# EAGLE design bldcshield (EAGLE 8.5.0)
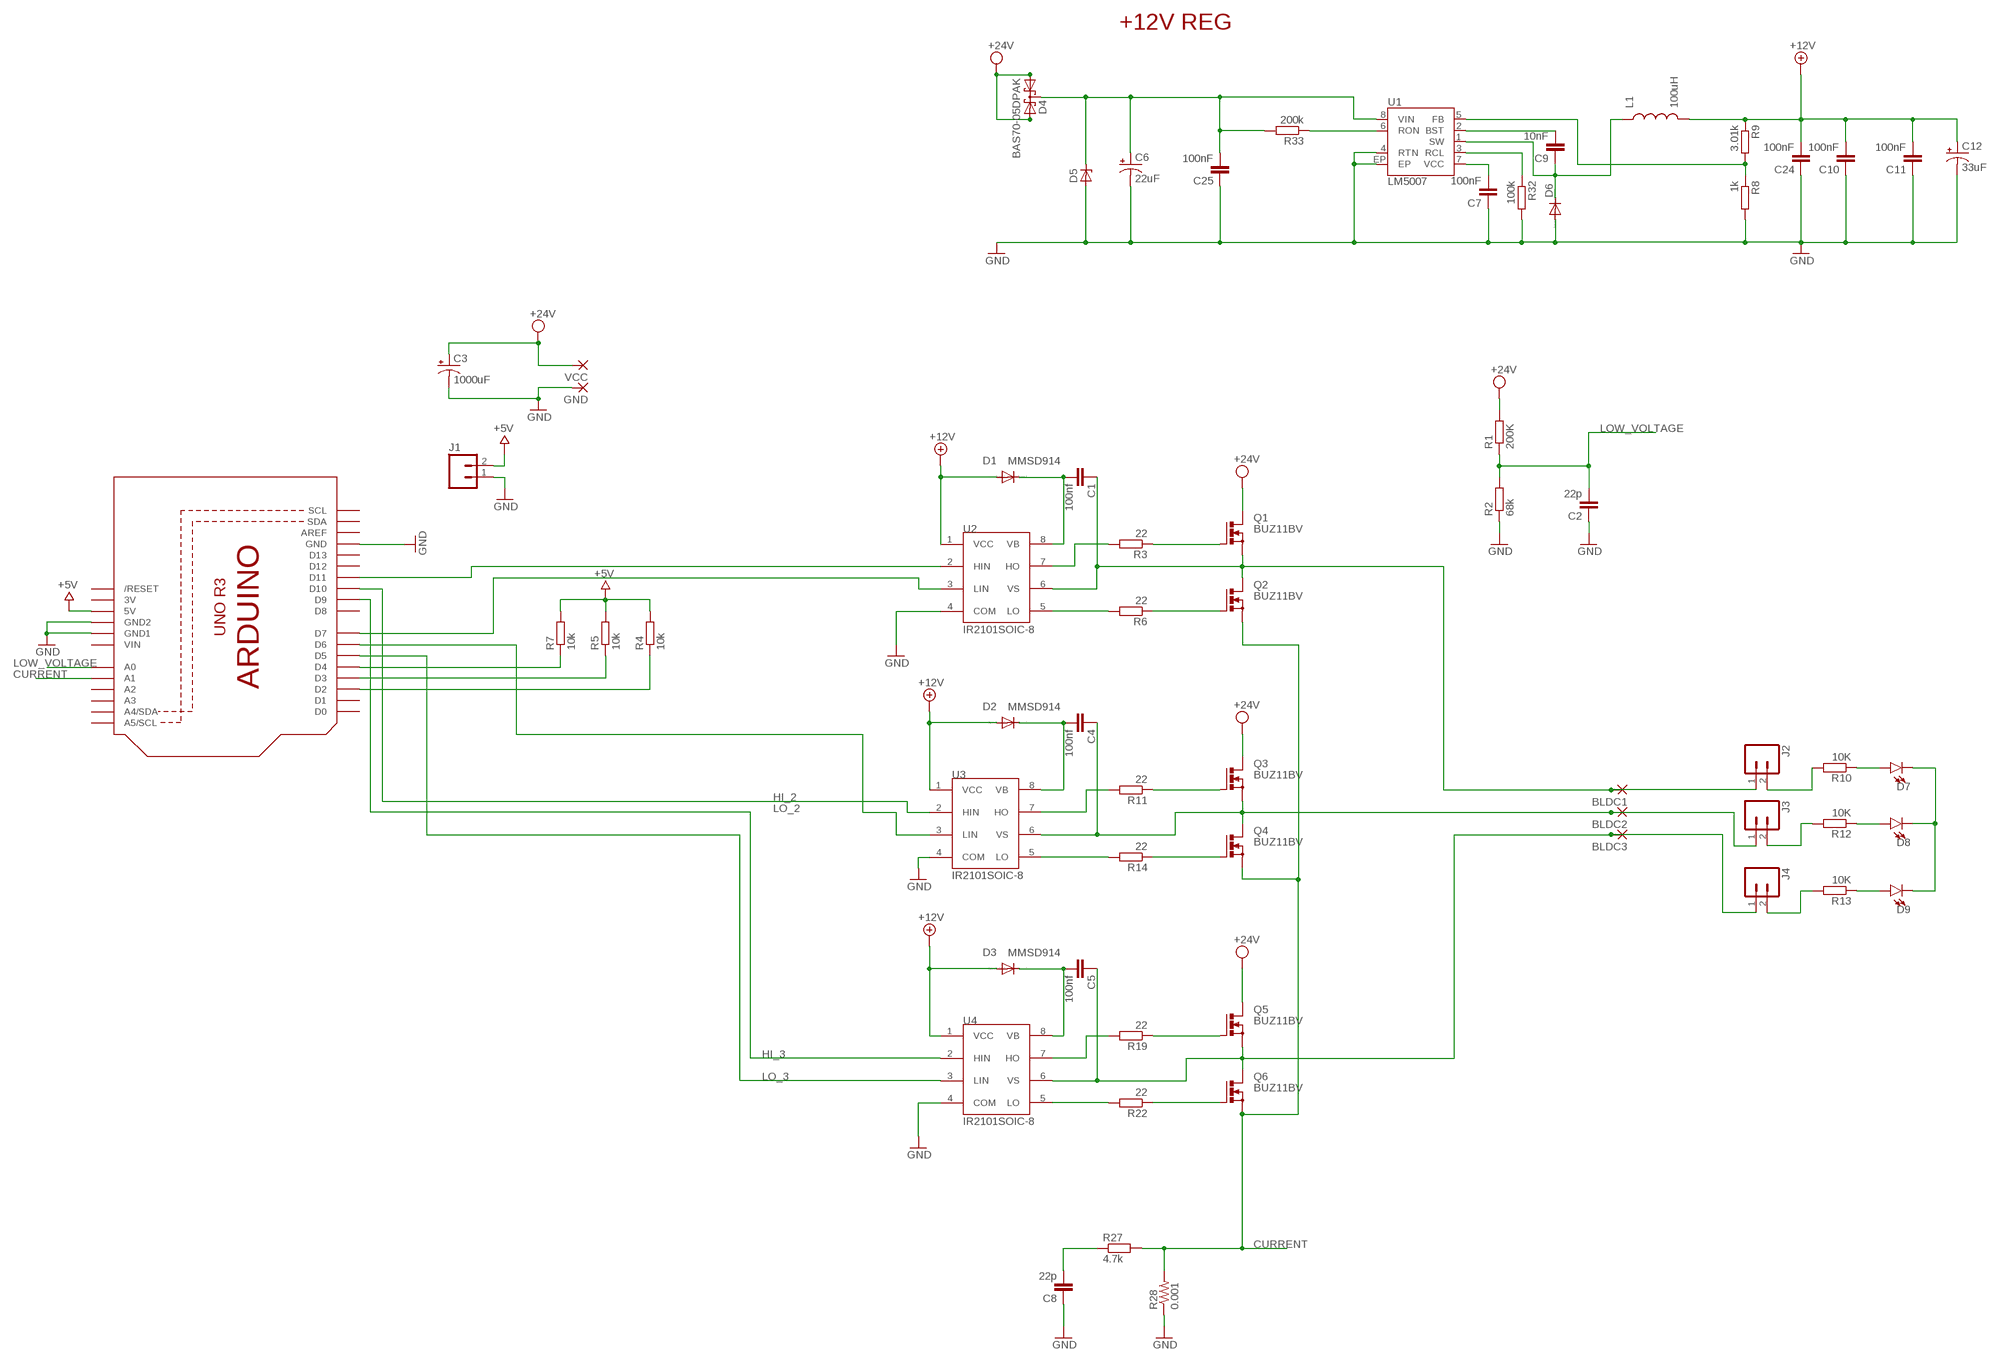
[diagram p0: schematic, sheet 1]

## Parts
BLDC1  WIREPAD4,16O1,6  [4,16O1,6]
BLDC2  WIREPAD4,16O1,6  [4,16O1,6]
BLDC3  WIREPAD4,16O1,6  [4,16O1,6]
C1  100nf  C-EUC1206  [C1206]
C2  22p  C-EUC1206  [C1206]
C3  1000uF  CAP_POLPTH3  [CPOL-RADIAL-1000UF-63V]
C4  100nf  C-EUC1206  [C1206]
C5  100nf  C-EUC1206  [C1206]
C6  22uF  22UF-POLAR-PANASONIC_C-35V-20%  [PANASONIC_C]
C7  100nF  C-EUC1206  [C1206]
C8  22p  C-EUC1206  [C1206]
C9  10nF  C-EUC1206  [C1206]
C10  100nF  C-EUC1206  [C1206]
C11  100nF  C-EUC1206  [C1206]
C12  33uF  22UF-POLAR-PANASONIC_C-35V-20%  [PANASONIC_C]
C24  100nF  C-EUC1206  [C1206]
C25  100nF  C-EUC1206  [C1206]
D1  MMSD914  DIODE-SOD123  [SOD123]
D2  MMSD914  DIODE-SOD123  [SOD123]
D3  MMSD914  DIODE-SOD123  [SOD123]
D4  BAS70-05DPAK  [DPAK229P990X238-3N]
D5  SMF43A  [SOD123F]
D6  MBR0520LT  [SOD123]
D7  LED5MM  [LED_5MM]
D8  LED5MM  [LED_5MM]
D9  LED5MM  [LED_5MM]
GND  WIREPAD4,16O1,6  [4,16O1,6]
J1  M02PTH  [1X02]
J2  M02PTH  [1X02]
J3  M02PTH  [1X02]
J4  M02PTH  [1X02]
L1  100uH  INDUCTOR  [INDUCTOR-SRP4020]
Q1  BUZ11BV  [TO220BV]
Q2  BUZ11BV  [TO220BV]
Q3  BUZ11BV  [TO220BV]
Q4  BUZ11BV  [TO220BV]
Q5  BUZ11BV  [TO220BV]
Q6  BUZ11BV  [TO220BV]
Q8  Shield  ARDUINOR3-NOIOREF-NOTEXT  [ARDUINOR3-NOTEXT-NOIOREF]
R1  200K  R-EU_R1206  [R1206]
R2  68k  R-EU_R1206  [R1206]
R3  22  R-EU_R1206  [R1206]
R4  10k  R-EU_R1206  [R1206]
R5  10k  R-EU_R1206  [R1206]
R6  22  R-EU_R1206  [R1206]
R7  10k  R-EU_R1206  [R1206]
R8  1k  R-EU_R1206  [R1206]
R9  3.01k  R-EU_R1206  [R1206]
R10  10K  R-EU_R1206  [R1206]
R11  22  R-EU_R1206  [R1206]
R12  10K  R-EU_R1206  [R1206]
R13  10K  R-EU_R1206  [R1206]
R14  22  R-EU_R1206  [R1206]
R19  22  R-EU_R1206  [R1206]
R22  22  R-EU_R1206  [R1206]
R27  4.7k  R-EU_R1206  [R1206]
R28  0.001  R-US_R2512  [R2512]
R32  100k  R-EU_R1206  [R1206]
R33  200k  R-EU_R1206  [R1206]
U1  LM5007  [MSOP-8-EP]
U2  IR2101SOIC-8  [SOIC127P490X600X175-8N]
U3  IR2101SOIC-8  [SOIC127P490X600X175-8N]
U4  IR2101SOIC-8  [SOIC127P490X600X175-8N]
VCC  WIREPAD4,16O1,6  [4,16O1,6]

## Nets
+5V [usbvcc]: J1.2 Q8.5V R4.2 R5.2 R7.2
+12V: C10.2 C11.2 C12.+ C24.2 D1.A D2.A D3.A L1.P$2 R9.1 U2.1(VCC) U3.1(VCC) U4.1(VCC)
BLDC1: BLDC1.1(P) C1.1 J2.1 Q1.S Q2.D U2.6(VS)
BLDC2: BLDC2.1(P) C4.1 J3.1 Q3.S Q4.D U3.6(VS)
BLDC3: BLDC3.1(P) C5.1 J4.1 Q5.S Q6.D U4.6(VS)
CURRENT: Q2.S Q4.S Q6.S Q8.A1 R27.2 R28.2
GND [gnd]: C2.1 C3.2(-) C6.- C7.1 C8.1 C10.1 C11.1 C12.- C24.1 C25.1 D5.A D6.A GND.1(P) J1.1 Q8.GND Q8.GND1 Q8.GND2 R2.1 R8.2 R28.1 R32.2 U1.4(RTN) U1.EP U2.4(COM) U3.4(COM) U4.4(COM)
HI_2: Q8.D10 U3.2(HIN)
HI_3: Q8.D9 U4.2(HIN)
LO_2: Q8.D6 U3.3(LIN)
LO_3: Q8.D5 U4.3(LIN)
LOW_VOLTAGE: C2.2 Q8.A0 R1.1 R2.2
N$1: Q3.G R11.1
N$2: C6.+ C25.2 D4.4(K1K2) D5.C R33.2 U1.8(VIN)
N$4: Q8.D11 U2.2(HIN)
N$5: Q8.D4 R7.1
N$6: Q8.D3 R5.1
N$7: Q8.D2 R4.1
N$8: Q8.D7 U2.3(LIN)
N$9: C8.2 R27.1
N$10: R6.2 U2.5(LO)
N$11: R3.2 U2.7(HO)
N$12: R33.1 U1.6(RON)
N$13: R19.2 U4.7(HO)
N$14: Q5.G R19.1
N$15: Q6.G R22.1
N$16: R22.2 U4.5(LO)
N$17: C9.2 U1.2(BST)
N$18: C7.2 U1.7(VCC)
N$19: C9.1 D6.C L1.P$1 U1.1(SW)
N$20: R32.1 U1.3(RCL)
N$21: R11.2 U3.7(HO)
N$23: Q4.G R14.1
N$24: R14.2 U3.5(LO)
N$25: J2.2 R10.2
N$26: R8.1 R9.2 U1.5(FB)
N$27: J3.2 R12.2
N$28: J4.2 R13.2
N$29: D7.A R10.1
N$30: Q1.G R3.1
N$31: Q2.G R6.1
N$32: D8.A R12.1
N$33: D9.A R13.1
N$34: D7.K(C) D8.K(C) D9.K(C)
VB1 [usbvcc]: C1.2 D1.C U2.8(VB)
VB2 [usbvcc]: C4.2 D2.C U3.8(VB)
VB3 [usbvcc]: C5.2 D3.C U4.8(VB)
VCC: C3.1(+) D4.1(A1) D4.3(A2) Q1.D Q3.D Q5.D R1.2 VCC.1(P) ; supply symbol labelled +24V
Unconnected: Q8.A2 Q8.A3 Q8.A4(A4/SDA) Q8.A5(A5/SCL) Q8.AREF Q8.D0 Q8.D1 Q8.D8 Q8.D12 Q8.D13 Q8.RESET(/RESET) Q8.SCL Q8.SDA

## Notes on the sheet
- +12V REG

## Power pins joined to a net without a drawn wire
3V: Q8.3V
VIN: Q8.VIN

## Library data of the parts
BLDC1-BLDC3 GND VCC = wirepad:WIREPAD: Wire PAD connect wire on PCB
C1 C2 C4 C5 C7-C11 C24 C25 = SmartPrj:C-EU: CAPACITOR, European symbol
C3 = SparkFun-Passives:CAP_POL: Capacitor Polarized These are standard SMD and PTH capacitors. Normally 10uF, 47uF, and 100uF in electrolytic and tantalum varieties. Always verify the external diameter of the through hole cap, it varies with capacity, voltage, and manufacturer. The EIA devices should be standard.
C6 = SparkFun-Capacitors:22UF-POLAR: 22µF polarized capacitors A capacitor is a passive two-terminal electrical component used to store electrical energy temporarily in an electric field.; PROD_ID: CAP-08618
C12 = SparkFun-Capacitors:22UF-POLAR: 22µF polarized capacitors A capacitor is a passive two-terminal electrical component used to store electrical energy temporarily in an electric field.; PROD_ID: CAP-08618; VALUE: 22uF
D1-D3 = diode:DIODE-: DIODE
D4 = SCHOTTKY:BAS70-05: General-purpose Schottky diodes General-purpose Schottky diodes in small Surface-Mounted Device (SMD) plastic packages AAL Eindhoven MK
D5 = smf_11:SMF*A: SMF Series TVS Diodes Source: http://www.littelfuse.com/~/media/electronics/datasheets/tvs_diodes/littelfuse_tvs_diode_smf_datasheet.pdf.pdf; MF: Littelfuse; MPN: SMF43A; OC_FARNELL: unknown; OC_NEWARK: unknown
D6 = diode:MBR0520LT: SCHOTTKY BARRIER RECTIFIER Source: http://onsemi.com .. MBR0520LT1-D.pdf
D7-D9 = SparkFun-LED:LED: LED (Generic) Standard schematic elements and footprints for 5mm, 3mm, 1206, and 0603 sized LEDs. Generic LEDs with no color specified.
J1-J4 = SparkFun-Connectors:M02: Standard 2-pin 0.1" header. Use with - straight break away headers ( PRT-00116) - right angle break away headers (PRT-00553) - swiss pins (PRT-00743) - machine pins (PRT-00117) - female headers (PRT-00115) Molex polarized connector foot print use with: PRT-08233 with associated crimp pins and housings. 2.54_SCREWTERM for use with PRT-10571. 3.5mm Screw Terminal footprints for PRT-08084 5mm Screw Terminal footprints for use with PRT-08432
L1 = SparkFun-Passives:INDUCTOR: Inductors Basic Inductor/Choke - 0603 and 1206. Footprints are not proven and vary greatly between part numbers. INDUCTOR POWER 3.3UH 4.0A SMD 0.197" L x 0.197" W x 0.177" H (5.00mm x 5.00mm x 4.50mm)
Q1-Q6 = transistor-power:BUZ11: N-CHANNEL MOS FET
Q8 = adafruit:ARDUINOR3-NOIOREF
R1-R14 R19 R22 R27 R32 R33 = SmartPrj:R-EU_: RESISTOR, European symbol
R28 = resistor:R-US_: RESISTOR, American symbol
U1 = SparkFun-PowerIC:LM5007: High Voltage (80V) Step-down switching regulator http://www.national.com/ds/LM/LM5007.pdf
U2-U4 = SnapEDA-Library:IR2101: High and low side driver

## Net classes
0 default: width 0.254 mm, drill 0.61 mm, clearance 0.203 mm
2 gnd: width 0.254 mm, drill 0.61 mm, clearance 0.254 mm
3 usbvcc: width 0.254 mm, drill 0.61 mm, clearance 0.254 mm

## Board
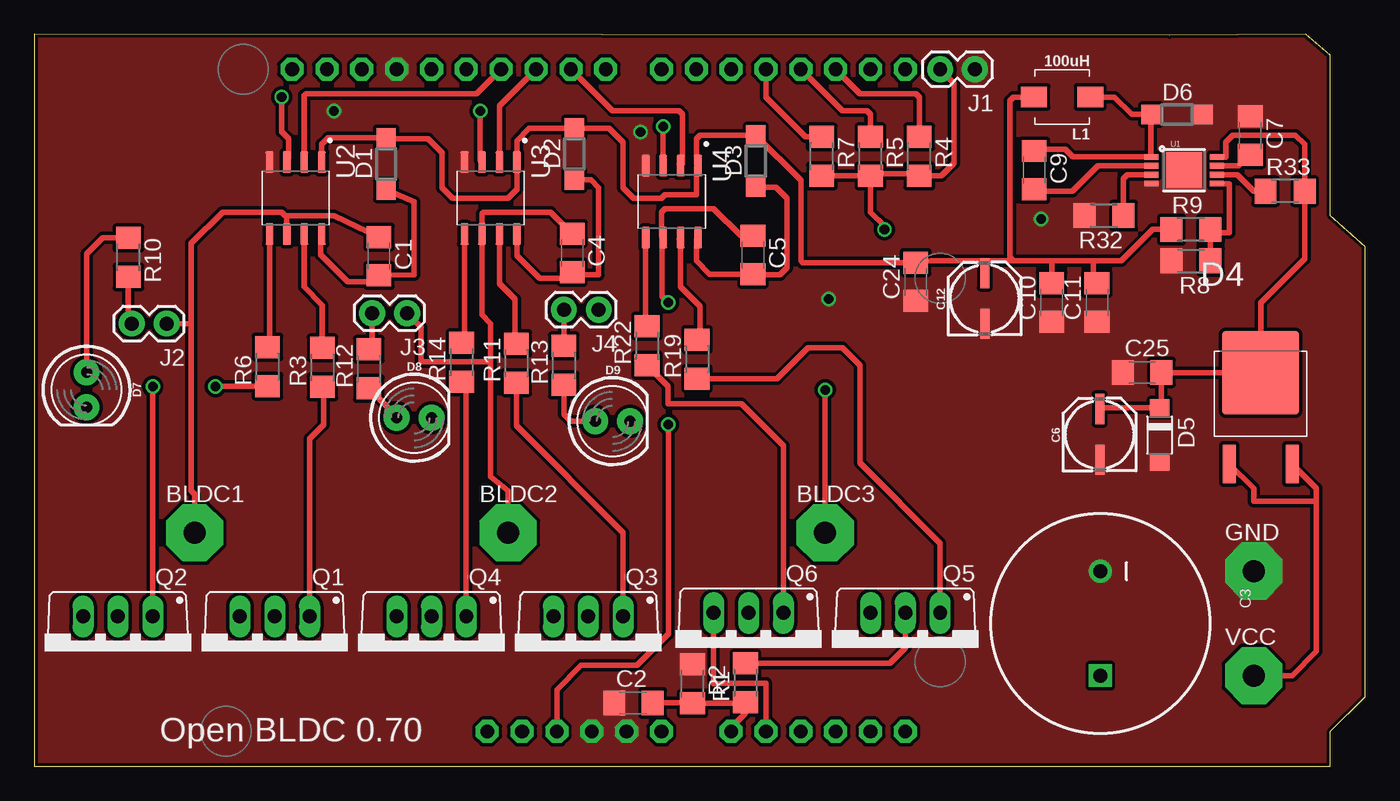
[diagram p1: board, top side]
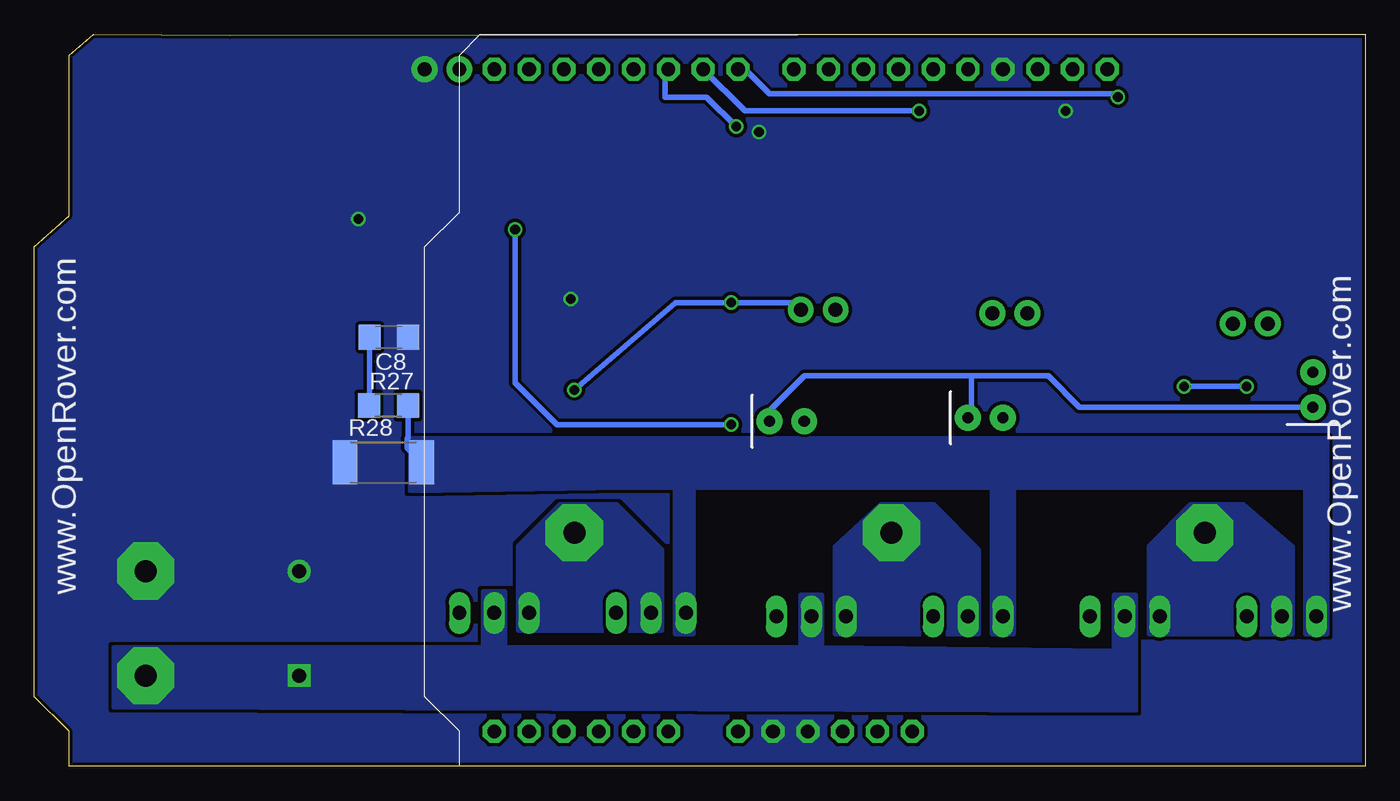
[diagram p2: board, bottom side, seen from below]

Size 97.03 x 53.34 mm. Coordinates in mm from the lower left corner, seen from the top.
Outline: 0,0 94.49,0 94.49,2.54 97.03,5.08 97.03,37.85 94.49,40.13 94.49,51.82 92.71,53.34 82.78,53.26 0,53.34 0,0
Copper layers (1*16): Top 0.035mm / dielectric 1.5mm / Bottom 0.035mm
Design rules "dirt_cheap_dirty_boards.v1": minimum track width 5mil, minimum drill 12mil, track to track 5mil, track to pad 5mil, pad to pad 5mil, via to via 5mil, smd to smd 0mil, copper to edge 10mil, drill to drill 10mil, minimum pad ring 10mil, minimum via ring 6mil, stop-mask expansion 2mil, vias tented up to drill 25mil, thermal gap 10mil

### Footprints (pad centres in the part's own frame; a part is rotated, then mirrored left to right if it is on the bottom)
4,16O1,6 = drill 1.6 pad 4.166 octagon: 1 0,0
C1206 = smd 1.6 x 1.8: 1 -1.4,0; 2 1.4,0
CPOL-RADIAL-1000UF-63V = drill 1.016 pad 1.651 square: 1 3.81,0 | drill 1.016 pad 1.676: 2 -3.81,0
PANASONIC_C = smd 2.2 x 0.65: + 1.9,-0.2; - -1.8,-0.2
SOD123 = smd 1.4 x 1.4: A 1.9,0; C -1.9,0
DPAK229P990X238-3N = smd 0.97 x 2.83: 1 -2.29,-4.14; 3 2.29,-4.14 | smd 5.63 x 6.09: 4 0,2.51
SOD123F = smd 1.2 x 1.4: A 2,0; C -2,0
LED_5MM = drill 0.813 pad 1.88: A -1.27,0; K 1.27,0
1X02 = drill 1.016 pad 1.88: 1 0,0; 2 2.54,0
INDUCTOR-SRP4020 = smd 1.9 x 1.5: P$1 -2.05,0; P$2 2.05,0
TO220BV = drill 1.016 long: D 0,-2.54; G -2.54,-2.54; S 2.54,-2.54
ARDUINOR3-NOTEXT-NOIOREF = drill 1 pad 1.676 octagon: 3V 35.56,2.54; 5V 38.1,2.54; A0 50.8,2.54; A1 53.34,2.54; A2 55.88,2.54; A3 58.42,2.54; A4 60.96,2.54; A5 63.5,2.54; AREF 23.876,50.8; D0 63.5,50.8; D1 60.96,50.8; D2 58.42,50.8; D3 55.88,50.8; D4 53.34,50.8; D5 50.8,50.8; D6 48.26,50.8; D7 45.72,50.8; D8 41.656,50.8; D9 39.116,50.8; D10 36.576,50.8; D11 34.036,50.8; D12 31.496,50.8; D13 28.956,50.8; GND 26.416,50.8; GND1 43.18,2.54; GND2 40.64,2.54; RESET 33.02,2.54; SCL 18.796,50.8; SDA 21.336,50.8; VIN 45.72,2.54
R1206 = smd 1.6 x 1.803: 1 -1.422,0; 2 1.422,0
R2512 = smd 1.8 x 3.2: 1 -2.8,0; 2 2.8,0
MSOP-8-EP = smd 0.41 x 1.02: 1 -0.975,-2.4; 2 -0.325,-2.4; 3 0.325,-2.4; 4 0.975,-2.4; 5 0.975,2.4; 6 0.325,2.4; 7 -0.325,2.4; 8 -0.975,2.4 | smd 2.6 x 2.6: EP 0,0
SOIC127P490X600X175-8N = smd 1.58 x 0.59: 1 -2.625,1.905; 2 -2.625,0.635; 3 -2.625,-0.635; 4 -2.625,-1.905; 5 2.625,-1.905; 6 2.625,-0.635; 7 2.625,0.635; 8 2.625,1.905

### Placement (x,y rotation side)
BLDC1  11.68,17.02 0 top
BLDC2  34.54,17.02 0 top
BLDC3  57.66,17.02 0 top
C1  25.13,37.17 270 top
C2  43.68,4.61 0 top
C3  77.72,10.41 270 top
C4  39.21,37.41 270 top
C5  52.39,37.27 270 top
C6  77.47,24.13 90 top
C7  88.65,45.97 270 top
C8  71.17,31.26 180 bottom
C9  72.9,43.43 270 top
C10  74.17,33.78 90 top
C11  77.47,33.78 90 top
C12  69.09,34.04 90 top
C24  64.26,35.31 90 top
C25  80.77,28.7 0 top
D1  25.65,43.89 90 top
D2  39.37,44.62 90 top
D3  52.59,44.1 90 top
D4  89.41,26.16 0 top
D5  82.04,24.13 270 top
D6  83.31,47.5 0 top
D7  3.81,27.43 270 top
D8  27.69,25.4 0 top
D9  42.16,25.15 0 top
GND  88.9,14.22 0 top
J1  68.58,50.8 180 top
J2  9.65,32.26 180 top
J3  27.18,33.02 180 top
J4  41.15,33.27 180 top
L1  74.93,48.77 180 top
Q1  17.53,8.38 180 top
Q2  6.1,8.38 180 top
Q3  40.39,8.38 180 top
Q4  28.96,8.38 180 top
Q5  63.5,8.64 180 top
Q6  52.07,8.64 180 top
Q8  0,0 0 top
R1  51.84,6.08 90 top
R2  47.98,6.01 270 top
R3  21,29.07 90 top
R4  64.52,44.45 270 top
R5  60.96,44.45 270 top
R6  17,29.13 90 top
R7  57.4,44.45 270 top
R8  84.33,36.83 180 top
R9  84.33,39.12 0 top
R10  6.86,37.08 270 top
R11  35.14,29.38 90 top
R12  24.38,28.96 90 top
R13  38.61,29.21 90 top
R14  31.14,29.44 90 top
R19  48.32,29.67 90 top
R22  44.68,30.65 90 top
R27  71.2,26.29 0 bottom
R28  71.59,22.15 0 bottom
R32  77.98,40.13 180 top
R33  91.19,41.91 0 top
U1  83.82,43.43 270 top
U2  19.05,41.4 270 top
U3  33.27,41.4 270 top
U4  46.48,41.15 270 top
VCC  88.9,6.6 0 top

### Tracks (layer width: path | path; a pad name or v marks a point on that pad's centre or on a via)
+5V  (via drill 0.7)
  Top 0.254: R5.2 61.01,43.09 61.01,43.18
  Top 0.406: R7.2 60.45,43.03 60.45,43.18 61.01,43.18 64.52,43.18 R4.2 66.14,43.03 67.06,43.94 67.06,49.78 J1.2 | Q8.5V 38.1,5.59 39.88,7.37 43.94,7.37 46.23,9.65 46.23,24.64 46.48,24.89 v46.23,24.89 | v61.98,39.12 61.98,39.37 60.96,40.39 R5.2
  Bottom 0.406: v46.23,24.89 58.93,24.89 61.98,27.94 v61.98,39.12
+12V
  Top 0.406: R9.1 81.53,39.12 79.25,36.83 77.22,36.83 | 77.22,36.83 74.17,36.83 | 74.17,36.83 71.37,36.83 | 71.37,36.83 71.12,37.08 71.12,48.51 71.37,48.77 L1.P$2 | 69.34,36.83 65.4,36.83 C24.2 56,36.71 55.88,36.83 55.88,42.71 D3.A 48.54,46 48.26,45.72 48.26,43.9 U4.1 48.26,43.65 48.26,41.66 45.97,41.66 45.72,41.4 43.69,41.4 42.93,42.16 42.93,45.47 41.91,46.48 39.41,46.48 D2.A 39.33,46.48 36.07,46.48 35.18,45.59 U3.1 35.18,42.04 34.54,41.4 30.48,41.4 29.72,42.16 29.72,44.7 28.7,45.72 25.73,45.72 D1.A 21.41,45.79 20.95,45.34 U2.1 | 69.34,36.83 71.37,36.83 | C10.2 74.17,36.83 | C11.2 77.22,35.44 77.22,36.83 | C12.+ 69.29,36.78 69.34,36.83
BLDC1
  Top 0.406: C1.1 21.84,40.13 18.54,40.13 | 18.54,40.13 18.29,40.13 18.03,40.39 13.72,40.39 11.43,38.1 11.43,32.26 | 18.54,40.13 18.41,40 U2.6 | 11.43,32.26 11.43,20.07 11.68,19.81 BLDC1.1 | J2.1 11.43,32.26
  pour Bottom (no thermals): 5.33,9.65 15.75,9.65 15.75,16 12.7,19.05 8.89,19.05 5.33,16
BLDC2
  Top 0.406: C4.1 37.64,40.39 32.77,40.39 32.64,40.26 U3.6 32.64,32.89 33.27,32.26 33.27,29.46 | 33.27,29.46 33.27,21.08 34.54,20.07 BLDC2.1 | J3.1 28.19,32 28.19,29.46 33.27,29.46
  pour Bottom (no thermals): 28.19,9.65 38.61,9.65 38.61,16 35.31,19.05 31.5,19.05 28.19,15.75
BLDC3  (via drill 0.7)
  Top 0.406: C5.1 51.5,38.67 49.53,40.64 45.97,40.64 45.72,40.39 45.72,38.65 U4.6 45.75,38.42 45.75,34.26 v46.23,33.78 | v57.66,27.43 BLDC3.1
  Bottom 0.406: v57.66,27.43 50.29,33.78 46.48,33.78 v46.23,33.78 41.66,33.78 J4.1
  pour Bottom (no thermals): 51.31,9.91 61.72,9.91 61.72,16 58.67,19.05 54.61,19.05 51.31,15.75
CURRENT
  Top 0.406: Q8.A1 53.34,6.04 50.26,6.04 49.52,6.03 49.53,6.04 Q6.S
  Bottom 0.406: 69.78,25.59 R27.2 69.78,23.94 69.85,23.88 69.85,23.2 R28.2 68.83,22.19
  pour Bottom (no thermals): 69.6,23.88 2.79,23.88 2.79,9.65 4.32,9.65 4.32,20.32 25.65,20.32 25.65,9.65 27.18,9.65 27.18,20.32 49.02,20.32 49.02,9.65 50.29,9.65 50.29,20.32 53.85,20.32 69.6,20.07
GND  (via drill 0.7)
  Top 0.254: 42.58,2.59
  other vias: 57.91,34.04 21.84,47.75 73.41,39.88 44.2,46.23
  pour Top (rank 3, no thermals): 0,53.34 0,0 94.49,0 94.49,2.54 97.03,5.08 97.03,37.59 94.49,40.13 94.49,51.56 94.23,51.56 92.46,53.34
  pour Bottom (rank 6, no thermals): 0,53.34 92.46,53.34 94.49,51.56 94.49,39.88 95,39.62 96.52,38.35 97.03,37.85 97.03,4.83 94.49,2.54 94.49,0 0,0
HI_2
  Top 0.406: Q8.D10 33.91,48.13 U3.2
HI_3
  Top 0.406: 46.99,43.9 47.1,43.79 | 47.1,43.79 U4.2 | Q8.D9 42.16,47.75 46.99,47.75 47.24,47.5 47.24,43.94 47.1,43.79
LO_2  (via drill 0.7)
  Top 0.406: v32.51,47.75 32.51,44.15 U3.3
  Bottom 0.406: Q8.D6 45.21,47.75 v32.51,47.75
LO_3  (via drill 0.7)
  Top 0.406: U4.3 v45.85,46.61
  Bottom 0.406: Q8.D5 51.05,50.55 51.05,48.77 48.01,48.77 v45.85,46.61
LOW_VOLTAGE
  Top 0.406: Q8.A0 50.8,2.79 51.82,3.81 51.82,4.63 R1.1 51.77,4.58 R2.2 47.95,4.61 C2.2
N$1
  Top 0.406: R11.1 35.14,24.8 42.93,17.02 Q3.G
N$2
  Top 0.406: C6.+ 77.77,26.13 D5.C 82.17,26.26 C25.2 82.2,28.67 D4.4 89.41,33.78 92.61,36.98 R33.2 92.61,45.31 91.95,45.97 87.38,45.97 86.87,45.47 86.87,44.37 86.26,44.37 U1.8
N$4
  Top 0.406: Q8.D11 32.26,49.02 19.81,49.02 19.69,48.89 U2.2
N$5
  Top 0.406: Q8.D4 53.34,48.77 56.24,45.87 R7.1
N$6
  Top 0.406: Q8.D3 58.93,47.75 60.71,47.75 60.96,47.5 R5.1
N$7
  Top 0.406: Q8.D2 60.2,49.02 64.26,49.02 64.52,48.77 R4.1
N$8  (via drill 0.7)
  Top 0.406: U2.3 18.34,44.11 18.54,44.31 18.54,45.72 18.03,46.23 v18.03,48.77
  Bottom 0.406: Q8.D7 45.21,50.8 43.43,49.02 18.29,49.02 v18.03,48.77
N$9
  Bottom 0.406: C8.2 72.57,26.35 R27.1
N$10
  Top 0.406: U2.5 17.14,30.69 R6.2
N$11
  Top 0.406: U2.7 19.69,34.92 21,33.61 R3.2
N$12
  Top 0.406: U1.6 87.7,43.11 88.9,41.91 R33.1
N$13
  Top 0.406: 47.02,38.42 U4.7 47.12,34.92 48.51,33.53 48.51,31.29 R19.2
N$14
  Top 0.254: R19.1 48.21,28.23
  Top 0.406: R19.1 54.16,28.25 56.39,30.48 58.93,30.48 60.2,29.21 60.2,22.1 66.04,16.26 Q5.G
N$15
  Top 0.406: Q6.G 54.61,23.37 51.56,26.42 46.22,26.42 46.22,27.69 R22.1
N$16
  Top 0.406: U4.5 44.58,32.17 R22.2
N$17
  Top 0.406: U1.2 77.54,43.76 75.69,41.91 73.02,41.91 C9.2
N$18
  Top 0.406: U1.7 87.83,43.76 C7.2
N$19
  Top 0.406: U1.1 81.28,44.41 | 81.28,44.41 75.73,44.41 75.18,44.96 73.02,44.96 C9.1 | L1.P$1 78.74,48.77 80.01,47.5 D6.C 81.41,44.54 81.28,44.41
N$20
  Top 0.406: U1.3 79.69,43.11 79.4,42.82 R32.1
N$21
  Top 0.406: U3.7 33.91,35.18 35.05,34.04 35.05,30.89 R11.2
N$23
  Top 0.254: 31.06,28 R14.1
  Top 0.406: Q4.G 31.5,27.67 R14.1
N$24
  Top 0.406: R14.2 31.37,31.09 U3.5
N$25
  Top 0.406: J2.2 6.86,32.51 R10.2
N$26
  Top 0.406: U1.5 87.08,42.46 87.12,42.42 87.12,38.86 86,38.86 | 86,38.86 R9.2 | R8.1 85.75,38.61 86,38.86
N$27
  Top 0.406: J3.2 24.64,30.63 R12.2
N$28
  Top 0.406: J4.2 R13.2
N$29
  Top 0.406: R10.1 4.98,38.51 3.81,37.34 D7.A
N$30
  Top 0.254: R3.1 20.89,27.66
  Top 0.406: Q1.G 20.07,23.88 21.08,24.89 21.08,27.56 R3.1
N$31  (via drill 0.7 pad 1.05)
  Top 0.254: R6.1 16.89,27.66
  Top 0.406: v13.21,27.69 16.76,27.69 R6.1 | Q2.G v8.64,27.69
  Bottom 0.406: v8.64,27.69 v13.21,27.69
N$32
  Top 0.406: R12.1 26.42,25.5 D8.A
N$33
  Top 0.406: R13.1 38.61,25.65 39.12,25.15 D9.A
N$34
  Bottom 0.406: D7.K 20.83,26.16 23.11,28.45 27.94,28.45 28.7,28.45 | 28.7,28.45 28.7,25.65 D8.K | D9.K 43.43,25.91 40.89,28.45 28.7,28.45
VB1
  Top 0.406: D1.C 27.69,41.15 27.69,35.81 C1.2 24.67,35.31 22.86,35.31 20.88,37.29 20.88,38.7 U2.8
VB2
  Top 0.406: D2.C 40.59,42.72 41.15,42.16 41.15,35.81 39.41,35.81 C4.2 38.76,35.56 36.83,35.56 35.18,37.21 U3.8
VB3
  Top 0.406: D3.C 54.07,42.2 54.86,41.4 54.86,36.32 54.36,35.81 52.45,35.81 C5.2 49.22,35.87 48.26,36.83 48.26,38.4 U4.8
VCC
  Top 0.406: 52.32,7.98 R1.2 62.37,7.5 63.5,8.64 Q5.D | VCC.1 91.69,6.6 93.47,8.38 93.47,19.3 | 93.47,19.3 93.47,20.25 D4.3 | D4.1 88.9,20.24 88.9,19.3 93.47,19.3
  pour Bottom (rank 3, no thermals): 16.76,12.45 18.29,12.45 18.29,8.38 39.62,8.64 39.62,12.45 41.15,12.45 41.15,8.64 62.74,8.64 62.74,12.7 64.26,12.7 64.26,8.64 91.19,8.64 91.19,4.32 16.76,4.06

### Text on the board
tPlace: Open BLDC 0.70
bPlace: www.OpenRover.com | www.OpenRover.com